# EAGLE design cpu (EAGLE 7.2.0)
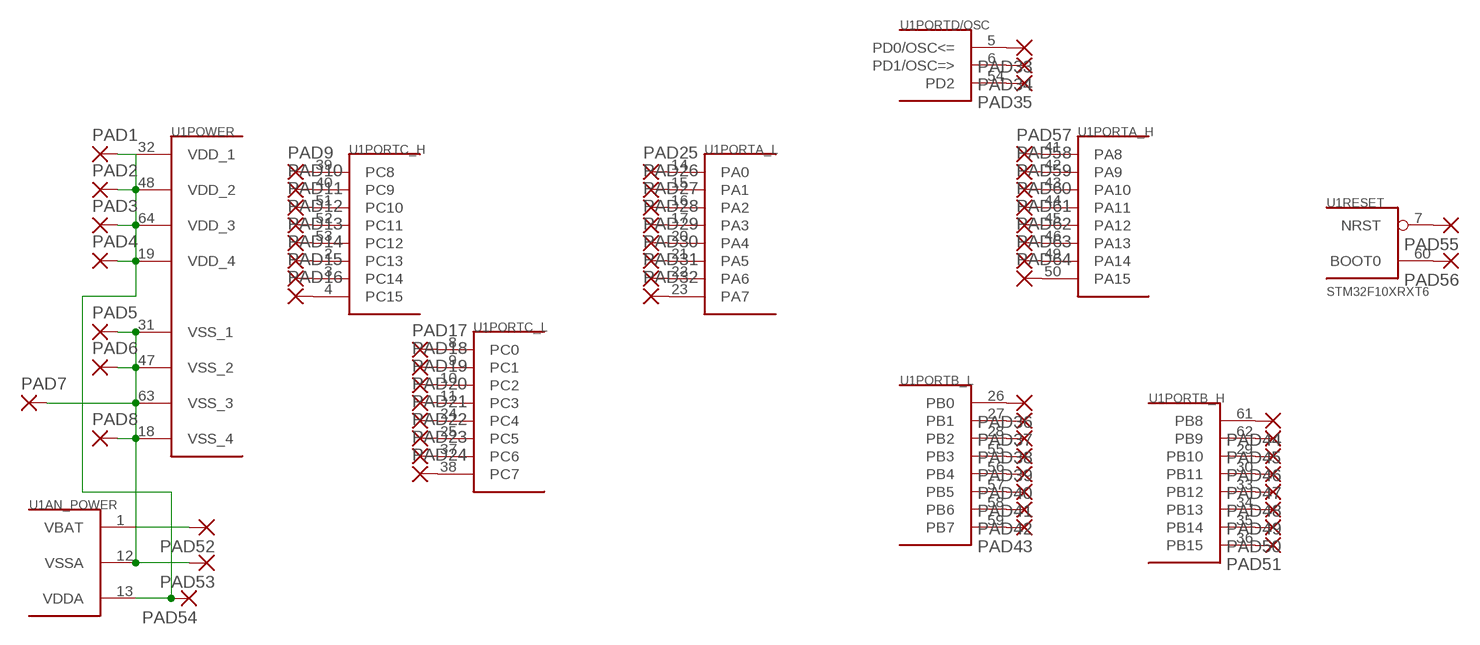
[diagram p0: schematic, sheet 1]

## Parts
PAD1  SMD2  [SMD1,27-2,54]
PAD2  SMD2  [SMD1,27-2,54]
PAD3  SMD2  [SMD1,27-2,54]
PAD4  SMD2  [SMD1,27-2,54]
PAD5  SMD2  [SMD1,27-2,54]
PAD6  SMD2  [SMD1,27-2,54]
PAD7  SMD2  [SMD1,27-2,54]
PAD8  SMD2  [SMD1,27-2,54]
PAD9  SMD2  [SMD1,27-2,54]
PAD10  SMD2  [SMD1,27-2,54]
PAD11  SMD2  [SMD1,27-2,54]
PAD12  SMD2  [SMD1,27-2,54]
PAD13  SMD2  [SMD1,27-2,54]
PAD14  SMD2  [SMD1,27-2,54]
PAD15  SMD2  [SMD1,27-2,54]
PAD16  SMD2  [SMD1,27-2,54]
PAD17  SMD2  [SMD1,27-2,54]
PAD18  SMD2  [SMD1,27-2,54]
PAD19  SMD2  [SMD1,27-2,54]
PAD20  SMD2  [SMD1,27-2,54]
PAD21  SMD2  [SMD1,27-2,54]
PAD22  SMD2  [SMD1,27-2,54]
PAD23  SMD2  [SMD1,27-2,54]
PAD24  SMD2  [SMD1,27-2,54]
PAD25  SMD2  [SMD1,27-2,54]
PAD26  SMD2  [SMD1,27-2,54]
PAD27  SMD2  [SMD1,27-2,54]
PAD28  SMD2  [SMD1,27-2,54]
PAD29  SMD2  [SMD1,27-2,54]
PAD30  SMD2  [SMD1,27-2,54]
PAD31  SMD2  [SMD1,27-2,54]
PAD32  SMD2  [SMD1,27-2,54]
PAD33  SMD2  [SMD1,27-2,54]
PAD34  SMD2  [SMD1,27-2,54]
PAD35  SMD2  [SMD1,27-2,54]
PAD36  SMD2  [SMD1,27-2,54]
PAD37  SMD2  [SMD1,27-2,54]
PAD38  SMD2  [SMD1,27-2,54]
PAD39  SMD2  [SMD1,27-2,54]
PAD40  SMD2  [SMD1,27-2,54]
PAD41  SMD2  [SMD1,27-2,54]
PAD42  SMD2  [SMD1,27-2,54]
PAD43  SMD2  [SMD1,27-2,54]
PAD44  SMD2  [SMD1,27-2,54]
PAD45  SMD2  [SMD1,27-2,54]
PAD46  SMD2  [SMD1,27-2,54]
PAD47  SMD2  [SMD1,27-2,54]
PAD48  SMD2  [SMD1,27-2,54]
PAD49  SMD2  [SMD1,27-2,54]
PAD50  SMD2  [SMD1,27-2,54]
PAD51  SMD2  [SMD1,27-2,54]
PAD52  SMD2  [SMD1,27-2,54]
PAD53  SMD2  [SMD1,27-2,54]
PAD54  SMD2  [SMD1,27-2,54]
PAD55  SMD2  [SMD1,27-2,54]
PAD56  SMD2  [SMD1,27-2,54]
PAD57  SMD2  [SMD1,27-2,54]
PAD58  SMD2  [SMD1,27-2,54]
PAD59  SMD2  [SMD1,27-2,54]
PAD60  SMD2  [SMD1,27-2,54]
PAD61  SMD2  [SMD1,27-2,54]
PAD62  SMD2  [SMD1,27-2,54]
PAD63  SMD2  [SMD1,27-2,54]
PAD64  SMD2  [SMD1,27-2,54]
U1  STM32F10XRXT6  [TQFP64]

## Nets
N$1: PAD1.1(P) PAD2.1(P) PAD3.1(P) PAD4.1(P) PAD54.1(P) U1.13(AN_POWER:VDDA) U1.19(POWER:VDD_4) U1.32(POWER:VDD_1) U1.48(POWER:VDD_2) U1.64(POWER:VDD_3)
N$2: PAD57.1(P) U1.41(PORTA_H:PA8)
N$3: PAD58.1(P) U1.42(PORTA_H:PA9)
N$4: PAD59.1(P) U1.43(PORTA_H:PA10)
N$5: PAD5.1(P) PAD6.1(P) PAD7.1(P) PAD8.1(P) PAD53.1(P) U1.12(AN_POWER:VSSA) U1.18(POWER:VSS_4) U1.31(POWER:VSS_1) U1.47(POWER:VSS_2) U1.63(POWER:VSS_3)
N$6: PAD60.1(P) U1.44(PORTA_H:PA11)
N$7: PAD61.1(P) U1.45(PORTA_H:PA12)
N$8: PAD62.1(P) U1.46(PORTA_H:PA13)
N$9: PAD9.1(P) U1.39(PORTC_H:PC8)
N$10: PAD10.1(P) U1.40(PORTC_H:PC9)
N$11: PAD11.1(P) U1.51(PORTC_H:PC10)
N$12: PAD12.1(P) U1.52(PORTC_H:PC11)
N$13: PAD13.1(P) U1.53(PORTC_H:PC12)
N$14: PAD14.1(P) U1.2(PORTC_H:PC13)
N$15: PAD15.1(P) U1.3(PORTC_H:PC14)
N$16: PAD16.1(P) U1.4(PORTC_H:PC15)
N$17: PAD17.1(P) U1.8(PORTC_L:PC0)
N$18: PAD18.1(P) U1.9(PORTC_L:PC1)
N$19: PAD19.1(P) U1.10(PORTC_L:PC2)
N$20: PAD20.1(P) U1.11(PORTC_L:PC3)
N$21: PAD21.1(P) U1.24(PORTC_L:PC4)
N$22: PAD22.1(P) U1.25(PORTC_L:PC5)
N$23: PAD23.1(P) U1.37(PORTC_L:PC6)
N$24: PAD24.1(P) U1.38(PORTC_L:PC7)
N$25: PAD25.1(P) U1.14(PORTA_L:PA0)
N$26: PAD26.1(P) U1.15(PORTA_L:PA1)
N$27: PAD27.1(P) U1.16(PORTA_L:PA2)
N$28: PAD28.1(P) U1.17(PORTA_L:PA3)
N$29: PAD29.1(P) U1.20(PORTA_L:PA4)
N$30: PAD30.1(P) U1.21(PORTA_L:PA5)
N$31: PAD31.1(P) U1.22(PORTA_L:PA6)
N$32: PAD32.1(P) U1.23(PORTA_L:PA7)
N$33: PAD33.1(P) U1.5(PORTD/OSC:PD0/OSC<=)
N$34: PAD34.1(P) U1.6(PORTD/OSC:PD1/OSC=>)
N$35: PAD35.1(P) U1.54(PORTD/OSC:PD2)
N$36: PAD36.1(P) U1.26(PORTB_L:PB0)
N$37: PAD37.1(P) U1.27(PORTB_L:PB1)
N$38: PAD38.1(P) U1.28(PORTB_L:PB2)
N$39: PAD39.1(P) U1.55(PORTB_L:PB3)
N$40: PAD40.1(P) U1.56(PORTB_L:PB4)
N$41: PAD41.1(P) U1.57(PORTB_L:PB5)
N$42: PAD42.1(P) U1.58(PORTB_L:PB6)
N$43: PAD43.1(P) U1.59(PORTB_L:PB7)
N$44: PAD44.1(P) U1.61(PORTB_H:PB8)
N$45: PAD45.1(P) U1.62(PORTB_H:PB9)
N$46: PAD46.1(P) U1.29(PORTB_H:PB10)
N$47: PAD47.1(P) U1.30(PORTB_H:PB11)
N$48: PAD48.1(P) U1.33(PORTB_H:PB12)
N$49: PAD49.1(P) U1.34(PORTB_H:PB13)
N$50: PAD50.1(P) U1.35(PORTB_H:PB14)
N$51: PAD51.1(P) U1.36(PORTB_H:PB15)
N$52: PAD52.1(P) U1.1(AN_POWER:VBAT)
N$53: PAD63.1(P) U1.49(PORTA_H:PA14)
N$54: PAD64.1(P) U1.50(PORTA_H:PA15)
N$55: PAD55.1(P) U1.7(RESET:NRST)
N$56: PAD56.1(P) U1.60(RESET:BOOT0)

## Library data of the parts
PAD1-PAD64 = wirepad:SMD2: SMD PAD
U1 = stm32:STM32F10XRXT6: STM32F101/103 64pin LQFP

## Board
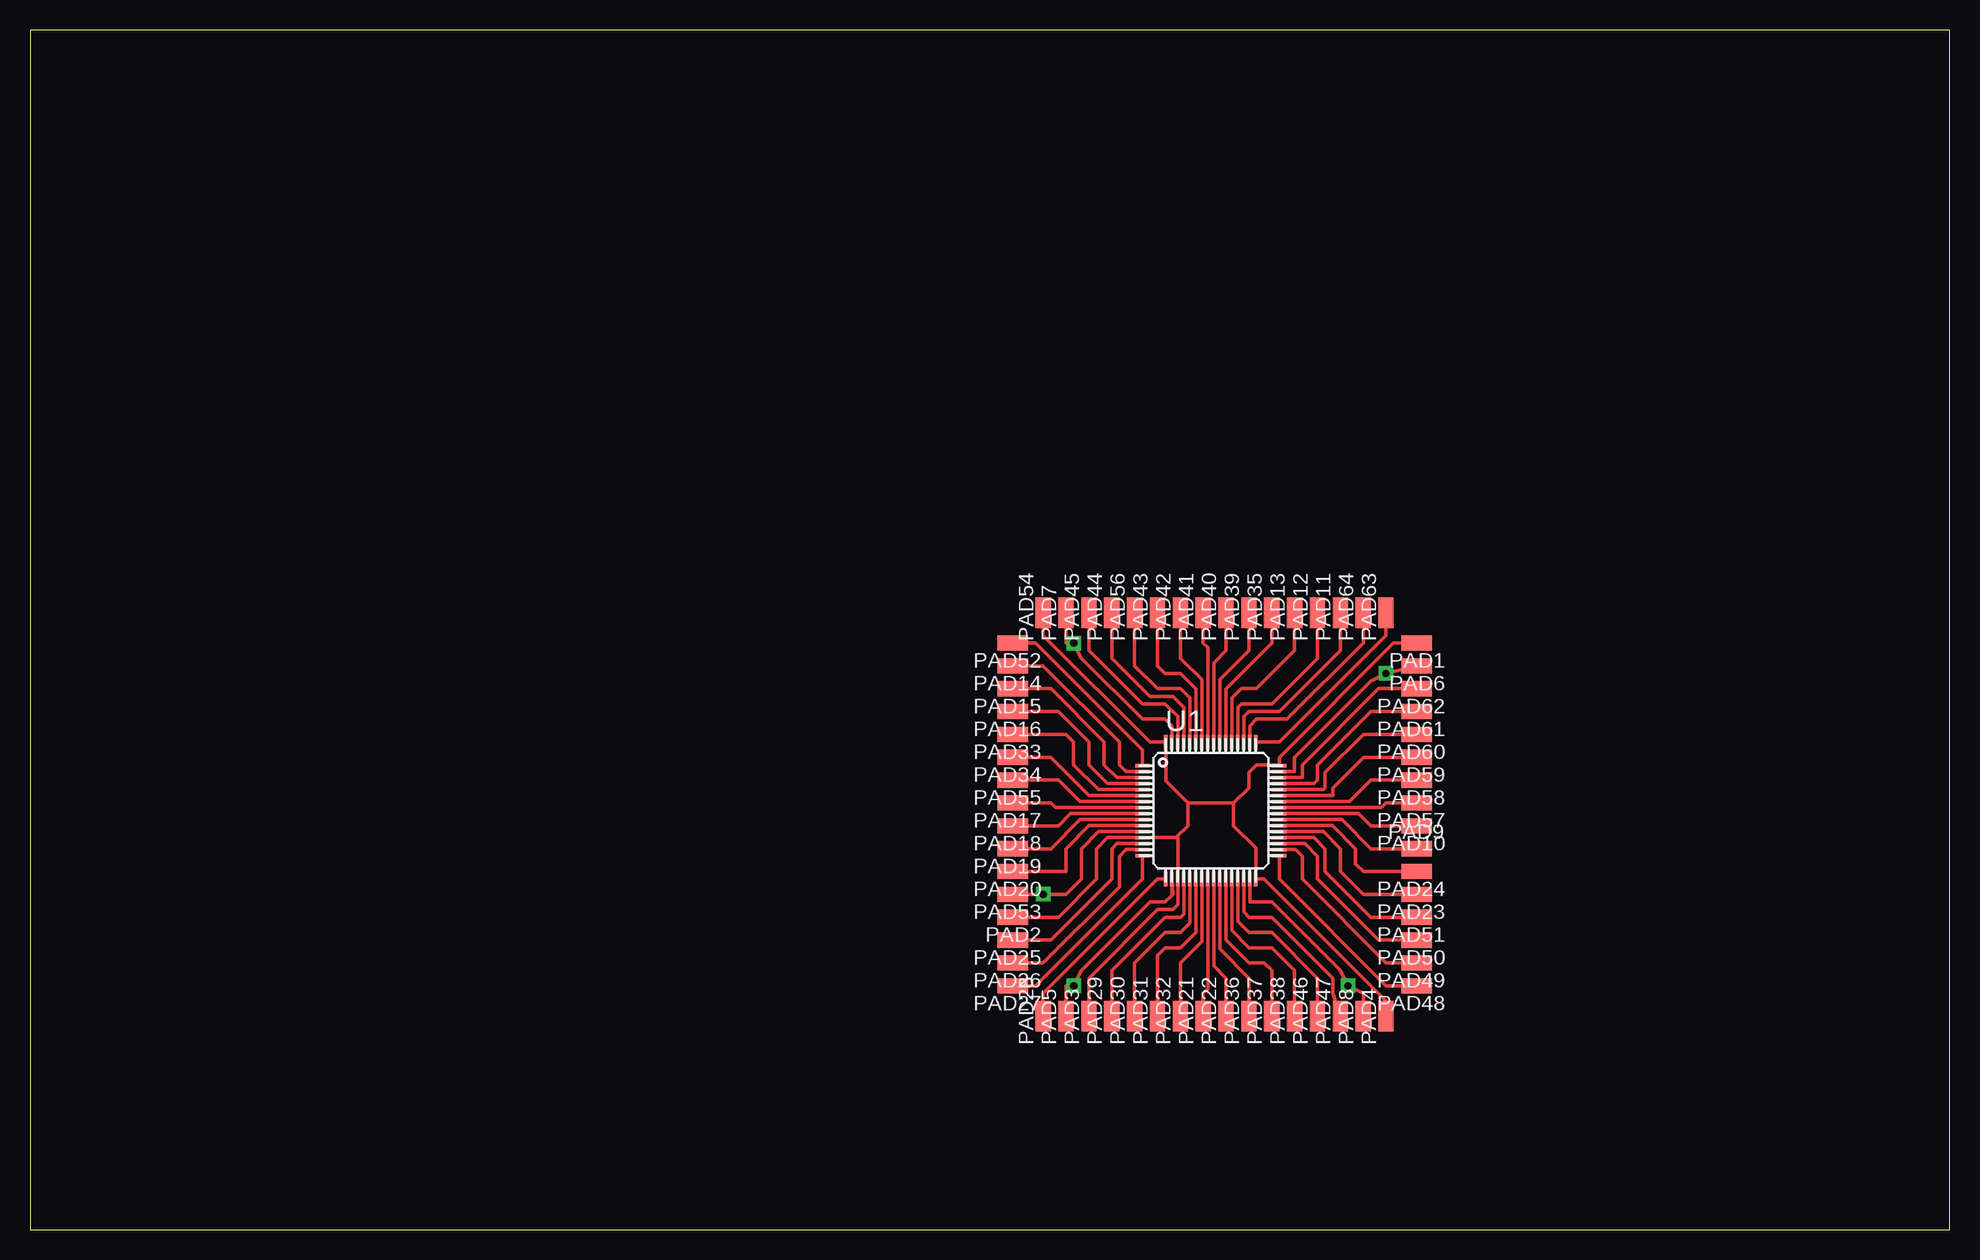
[diagram p1: board, top side]
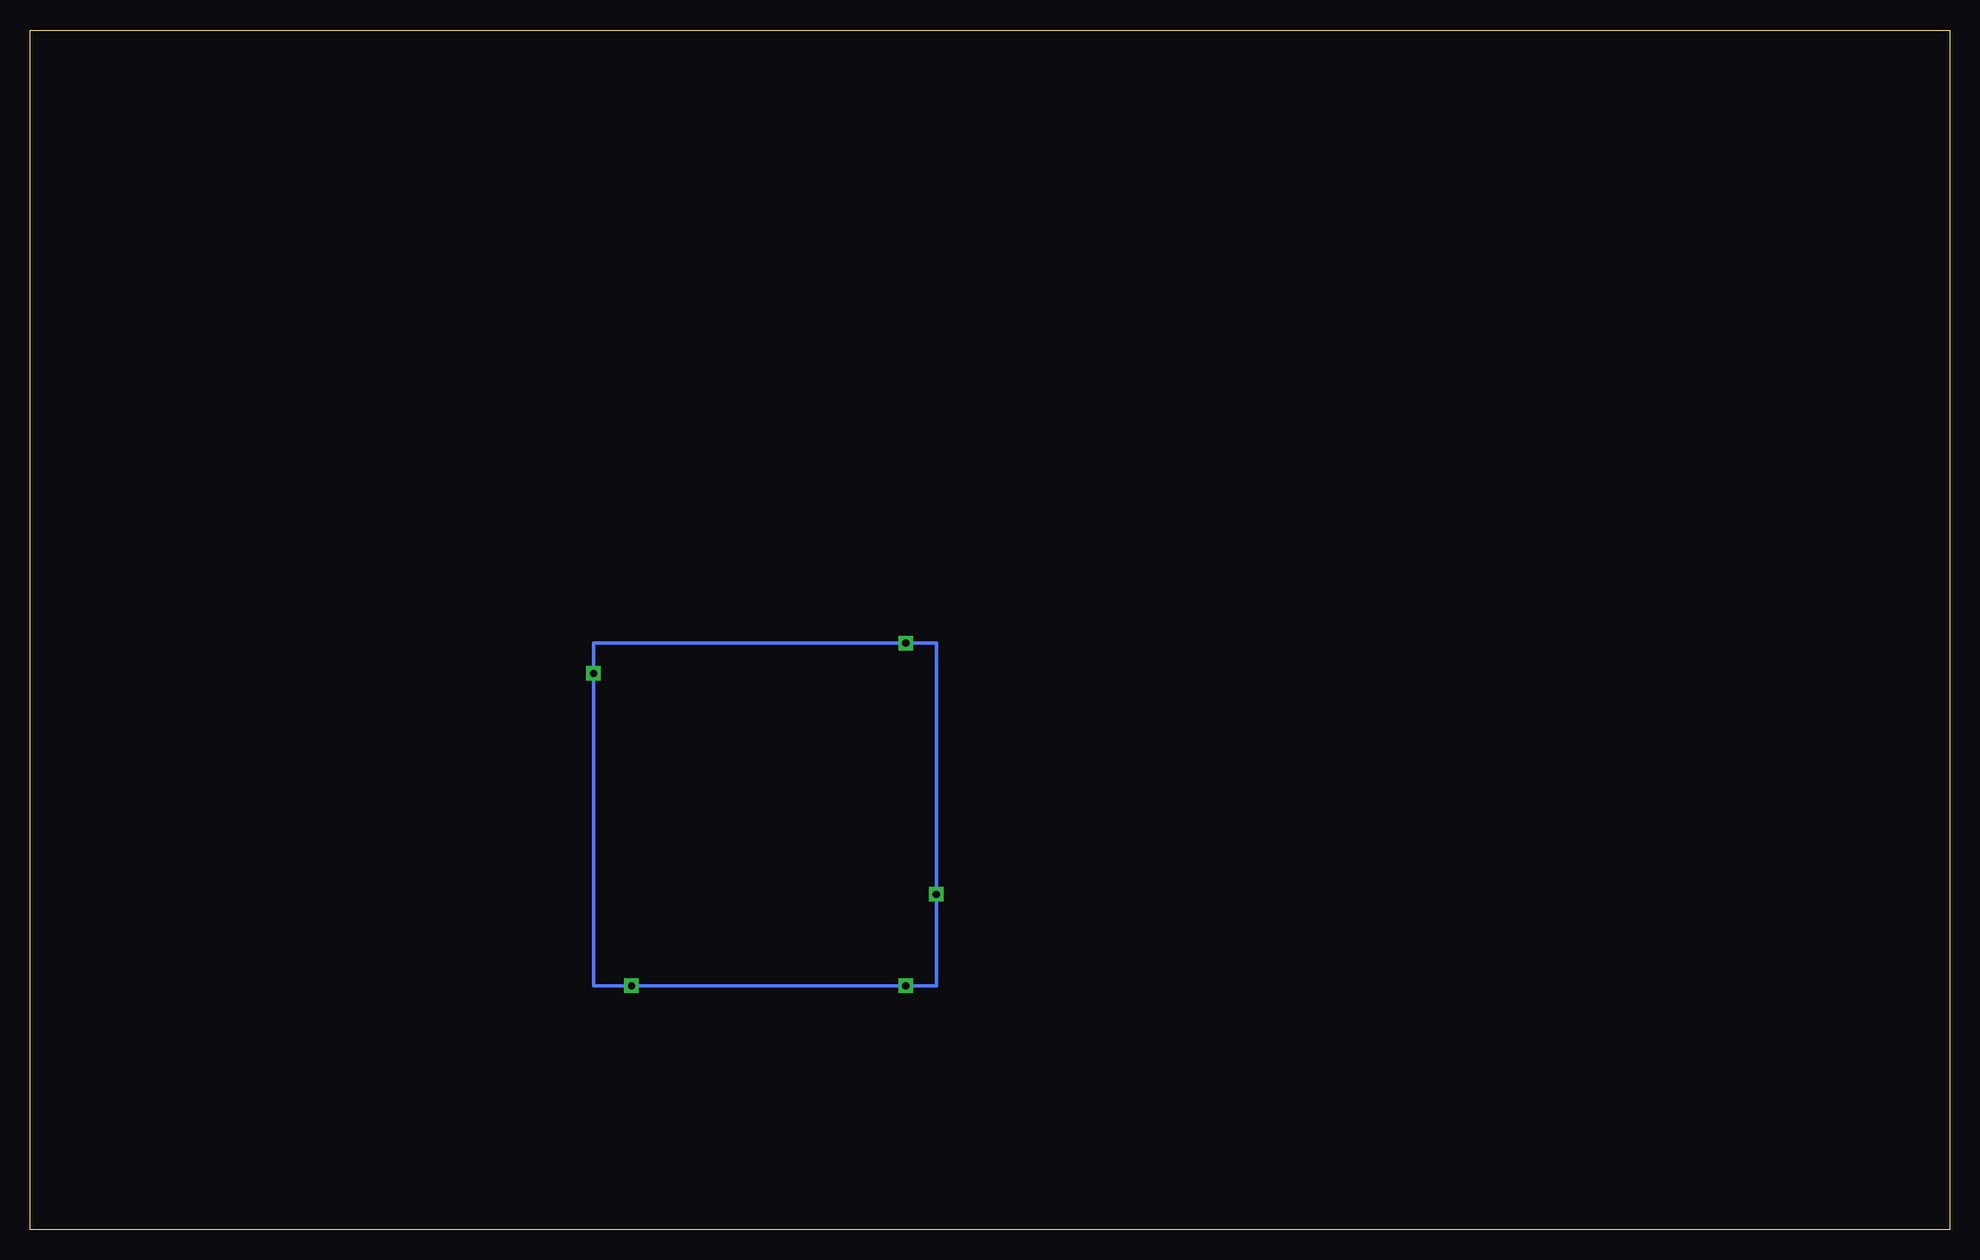
[diagram p2: board, bottom side, seen from below]

Size 160 x 100 mm. Coordinates in mm from the lower left corner, seen from the top.
Outline: 0,0 160,0 160,100 0,100 0,0
Copper layers (1*16): Top 0.035mm / dielectric 1.5mm / Bottom 0.035mm
Design rules "default *": minimum track width 10mil, minimum drill 24mil, track to track 8mil, track to pad 8mil, pad to pad 8mil, via to via 8mil, smd to smd 8mil, copper to edge 40mil, drill to drill 8mil, minimum pad ring 10mil, minimum via ring 12mil, stop-mask expansion 4mil, vias tented up to drill 0mil, thermal gap 10mil

### Footprints (pad centres in the part's own frame; a part is rotated, then mirrored left to right if it is on the bottom)
SMD1,27-2,54 = smd 1.27 x 2.54: 1 0,0
TQFP64 = smd 1.2 x 0.3: 1 -5.7,3.75; 2 -5.7,3.25; 3 -5.7,2.75; 4 -5.7,2.25; 5 -5.7,1.75; 6 -5.7,1.25; 7 -5.7,0.75; 8 -5.7,0.25; 9 -5.7,-0.25; 10 -5.7,-0.75; 11 -5.7,-1.25; 12 -5.7,-1.75; 13 -5.7,-2.25; 14 -5.7,-2.75; 15 -5.7,-3.25; 16 -5.7,-3.75; 33 5.7,-3.75; 34 5.7,-3.25; 35 5.7,-2.75; 36 5.7,-2.25; 37 5.7,-1.75; 38 5.7,-1.25; 39 5.7,-0.75; 40 5.7,-0.25; 41 5.7,0.25; 42 5.7,0.75; 43 5.7,1.25; 44 5.7,1.75; 45 5.7,2.25; 46 5.7,2.75; 47 5.7,3.25; 48 5.7,3.75 | smd 0.3 x 1.2: 17 -3.75,-5.7; 18 -3.25,-5.7; 19 -2.75,-5.7; 20 -2.25,-5.7; 21 -1.75,-5.7; 22 -1.25,-5.7; 23 -0.75,-5.7; 24 -0.25,-5.7; 25 0.25,-5.7; 26 0.75,-5.7; 27 1.25,-5.7; 28 1.75,-5.7; 29 2.25,-5.7; 30 2.75,-5.7; 31 3.25,-5.7; 32 3.75,-5.7; 49 3.75,5.7; 50 3.25,5.7; 51 2.75,5.7; 52 2.25,5.7; 53 1.75,5.7; 54 1.25,5.7; 55 0.75,5.7; 56 0.25,5.7; 57 -0.25,5.7; 58 -0.75,5.7; 59 -1.25,5.7; 60 -1.75,5.7; 61 -2.25,5.7; 62 -2.75,5.7; 63 -3.25,5.7; 64 -3.75,5.7

### Placement (x,y rotation side)
PAD1  115.57,48.9 90 top
PAD2  81.92,26.04 90 top
PAD3  88.27,17.78 0 top
PAD4  113.03,17.78 0 top
PAD5  86.36,17.78 0 top
PAD6  115.57,46.99 90 top
PAD7  86.36,51.44 0 top
PAD8  111.12,17.78 0 top
PAD9  115.57,31.75 270 top
PAD10  115.57,33.66 90 top
PAD11  109.22,51.44 0 top
PAD12  107.31,51.44 0 top
PAD13  105.41,51.44 0 top
PAD14  81.92,46.99 90 top
PAD15  81.92,45.09 90 top
PAD16  81.92,43.18 90 top
PAD17  81.92,35.56 90 top
PAD18  81.92,33.66 90 top
PAD19  81.92,31.75 90 top
PAD20  81.92,29.84 90 top
PAD21  97.79,17.78 0 top
PAD22  99.69,17.78 0 top
PAD23  115.57,27.94 90 top
PAD24  115.57,29.84 90 top
PAD25  81.92,24.13 90 top
PAD26  81.92,22.23 90 top
PAD27  81.92,20.32 90 top
PAD28  84.45,17.78 0 top
PAD29  90.17,17.78 0 top
PAD30  92.08,17.78 0 top
PAD31  93.98,17.78 0 top
PAD32  95.89,17.78 0 top
PAD33  81.92,41.27 90 top
PAD34  81.92,39.37 90 top
PAD35  103.5,51.44 0 top
PAD36  101.6,17.78 0 top
PAD37  103.5,17.78 0 top
PAD38  105.41,17.78 0 top
PAD39  101.6,51.44 0 top
PAD40  99.69,51.44 0 top
PAD41  97.79,51.44 0 top
PAD42  95.89,51.44 0 top
PAD43  93.98,51.44 0 top
PAD44  90.17,51.44 0 top
PAD45  88.27,51.44 0 top
PAD46  107.31,17.78 0 top
PAD47  109.22,17.78 0 top
PAD48  115.57,20.32 90 top
PAD49  115.57,22.23 90 top
PAD50  115.57,24.13 90 top
PAD51  115.57,26.04 90 top
PAD52  81.92,48.9 90 top
PAD53  81.92,27.94 90 top
PAD54  84.45,51.44 0 top
PAD55  81.92,37.47 90 top
PAD56  92.08,51.44 0 top
PAD57  115.57,35.56 90 top
PAD58  115.57,37.47 90 top
PAD59  115.57,39.37 90 top
PAD60  115.57,41.27 90 top
PAD61  115.57,43.18 90 top
PAD62  115.57,45.09 90 top
PAD63  113.03,51.44 0 top
PAD64  111.12,51.44 0 top
U1  98.42,34.92 0 top

### Tracks (layer width: path | path; a pad name or v marks a point on that pad's centre or on a via)
N$1
  Top 0.305: PAD4.1 113.03,19.05 102.86,29.23 U1.32 102.17,31.81 100.33,33.66 100.33,35.56 | PAD3.1 88.27,20.95 93.98,26.67 95.25,26.67 95.67,27.09 U1.19 95.67,32.67 95.54,32.67 | PAD2.1 85.72,26.04 88.9,29.21 88.9,31.75 89.83,32.67 U1.13 95.54,32.67 | PAD1.1 113.67,48.9 104.14,39.37 104.14,38.69 U1.48 104.06,38.73 102.23,38.73 101.6,38.1 101.6,36.83 100.33,35.56 | PAD54.1 84.45,49.53 93.34,40.64 94.66,40.64 U1.64 94.67,37.41 96.52,35.56 | 96.52,35.56 100.33,35.56 | 96.52,35.56 96.52,33.66 95.54,32.67
N$2
  Top 0.305: U1.41 112.64,35.17 113.03,35.56 PAD57.1
N$3
  Top 0.305: U1.42 109.97,35.67 111.76,37.47 PAD58.1
N$4
  Top 0.305: U1.43 108.56,36.17 108.58,36.2 108.58,36.83 111.12,39.37 PAD59.1
N$5  (via drill 0.6)
  Top 0.305: PAD8.1 111.12,19.68 v109.86,20.32 109.22,21.59 103.5,27.3 101.67,27.3 U1.31 | 95.17,27.86 U1.18 95.25,27.94 95.17,27.86 | 95.17,27.86 94.61,27.3 93.34,27.3 87.63,21.59 v87,20.32 86.36,20.32 PAD5.1 | PAD53.1 v84.45,27.94 86.36,27.94 87.63,29.21 87.63,31.75 89.06,33.17 U1.12 | PAD6.1 v113.03,46.35 111.76,45.72 105.41,39.37 105.41,38.17 U1.47 | PAD7.1 86.36,48.9 v87,48.9 87.63,47.62 92.71,42.55 94.61,42.55 95.17,41.98 U1.63
  Bottom 0.305: v87,20.32 84.45,20.32 v84.45,27.94 84.45,48.9 v87,48.9 113.03,48.9 v113.03,46.35 113.03,20.32 v109.86,20.32 v87,20.32
N$6
  Top 0.305: U1.44 107.8,36.67 107.95,36.83 107.95,38.1 111.12,41.27 PAD60.1
N$7
  Top 0.305: U1.45 107.03,37.17 107.31,37.47 107.31,38.73 111.76,43.18 PAD61.1
N$8
  Top 0.305: U1.46 105.62,37.67 106.05,37.67 106.05,38.73 112.39,45.09 PAD62.1
N$9
  Top 0.305: U1.39 109.33,34.17 111.76,31.75 PAD9.1
N$10
  Top 0.305: U1.40 110.74,34.67 111.76,33.66 PAD10.1
N$11
  Top 0.305: U1.51 101.17,42.76 101.6,43.18 104.14,43.18 109.22,48.26 PAD11.1
N$12
  Top 0.305: U1.52 100.67,43.52 100.97,43.81 103.5,43.81 107.31,47.62 PAD12.1
N$13
  Top 0.305: U1.53 100.17,44.3 100.97,45.09 102.23,45.09 105.41,48.26 PAD13.1
N$14
  Top 0.305: U1.2 91.36,38.17 90.81,38.73 90.81,40.64 84.45,46.99 PAD14.1
N$15
  Top 0.305: U1.3 90.59,37.67 89.53,38.73 89.53,40.64 85.09,45.09 PAD15.1
N$16
  Top 0.305: U1.4 89.83,37.17 88.27,38.73 88.27,40.64 85.72,43.18 PAD16.1
N$17
  Top 0.305: U1.8 85.47,35.17 85.09,35.56 PAD17.1
N$18
  Top 0.305: U1.9 86.75,34.67 85.72,33.66 PAD18.1
N$19
  Top 0.305: U1.10 87.52,34.17 85.09,31.75 PAD19.1
N$20
  Top 0.305: U1.11 88.28,33.67 86.36,31.75 86.36,29.84 PAD20.1
N$21
  Top 0.305: U1.24 98.17,20.07 97.79,19.68 PAD21.1
N$22
  Top 0.305: U1.25 98.67,21.98 99.69,20.95 PAD22.1
N$23
  Top 0.305: U1.37 107.8,33.17 109.22,31.75 109.22,29.84 111.12,27.94 PAD23.1
N$24
  Top 0.305: U1.38 108.56,33.67 110.49,31.75 110.49,30.48 111.12,29.84 PAD24.1
N$25
  Top 0.305: U1.14 90.59,32.17 90.17,31.75 90.17,29.21 85.09,24.13 PAD25.1
N$26
  Top 0.305: U1.15 91.36,31.68 90.81,31.11 90.81,28.57 84.45,22.23 PAD26.1
N$27
  Top 0.305: U1.16 92.72,29.23 83.82,20.32 PAD27.1
N$28
  Top 0.305: U1.17 94,29.23 84.45,19.68 PAD28.1
N$29
  Top 0.305: U1.20 96.17,26.32 95.89,26.04 94.61,26.04 90.17,21.59 PAD29.1
N$30
  Top 0.305: U1.21 96.67,25.55 95.89,24.77 94.61,24.77 92.08,22.23 PAD30.1
N$31
  Top 0.305: U1.22 97.17,24.79 95.89,23.5 94.61,23.5 93.98,22.86 PAD31.1
N$32
  Top 0.305: U1.23 97.67,24.02 95.89,22.23 PAD32.1
N$33
  Top 0.305: U1.5 89.06,36.67 87,38.73 87,40.64 86.36,41.27 PAD33.1
N$34
  Top 0.305: U1.6 88.28,36.17 85.09,39.37 PAD34.1
N$35
  Top 0.305: U1.54 99.67,45.06 103.5,48.9 PAD35.1
N$36
  Top 0.305: U1.26 99.17,23.38 101.6,20.95 PAD36.1
N$37
  Top 0.305: U1.27 99.67,24.15 101.6,22.23 102.87,22.23 103.5,21.59 PAD37.1
N$38
  Top 0.305: U1.28 100.17,24.92 101.6,23.5 103.5,23.5 105.41,21.59 PAD38.1
N$39
  Top 0.305: U1.55 99.17,45.84 101.6,48.26 PAD39.1
N$40
  Top 0.305: U1.56 98.67,47.24 99.69,48.26 PAD40.1
N$41
  Top 0.305: U1.57 98.17,48.51 97.79,48.9 PAD41.1
N$42
  Top 0.305: U1.58 97.67,45.84 95.89,47.62 PAD42.1
N$43
  Top 0.305: U1.59 97.17,45.06 95.89,46.35 94.61,46.35 93.98,46.99 PAD43.1
N$44
  Top 0.305: U1.61 96.17,43.52 95.25,44.45 93.34,44.45 90.17,47.62 PAD44.1
N$45
  Top 0.305: U1.62 95.67,42.76 94.61,43.81 92.71,43.81 88.27,48.26 PAD45.1
N$46
  Top 0.305: U1.29 100.67,25.69 101.6,24.77 103.5,24.77 107.31,20.95 PAD46.1
N$47
  Top 0.305: U1.30 101.17,26.46 101.6,26.04 103.5,26.04 108.58,20.95 108.58,19.68 PAD47.1
N$48
  Top 0.305: U1.33 104.12,29.23 113.03,20.32 PAD48.1
N$49
  Top 0.305: U1.34 105.48,31.68 106.05,31.11 106.05,29.21 113.03,22.23 PAD49.1
N$50
  Top 0.305: U1.35 106.25,32.17 107.31,31.11 107.31,29.21 112.39,24.13 PAD50.1
N$51
  Top 0.305: U1.36 107.03,32.67 107.95,31.75 107.95,29.84 111.76,26.04 PAD51.1
N$52
  Top 0.305: U1.1 92.72,39.99 83.82,48.9 PAD52.1
N$53
  Top 0.305: PAD63.1 113.03,49.53 104.14,40.64 102.19,40.64 U1.49
N$54
  Top 0.305: U1.50 101.67,41.98 102.23,42.55 104.78,42.55 111.12,48.9 PAD64.1
N$55
  Top 0.305: U1.7 87.52,35.67 85.72,37.47 PAD55.1
N$56
  Top 0.305: U1.60 96.67,44.3 95.89,45.09 93.98,45.09 92.08,46.99 PAD56.1